# EAGLE design ethernet chip board (EAGLE 7.5.0)
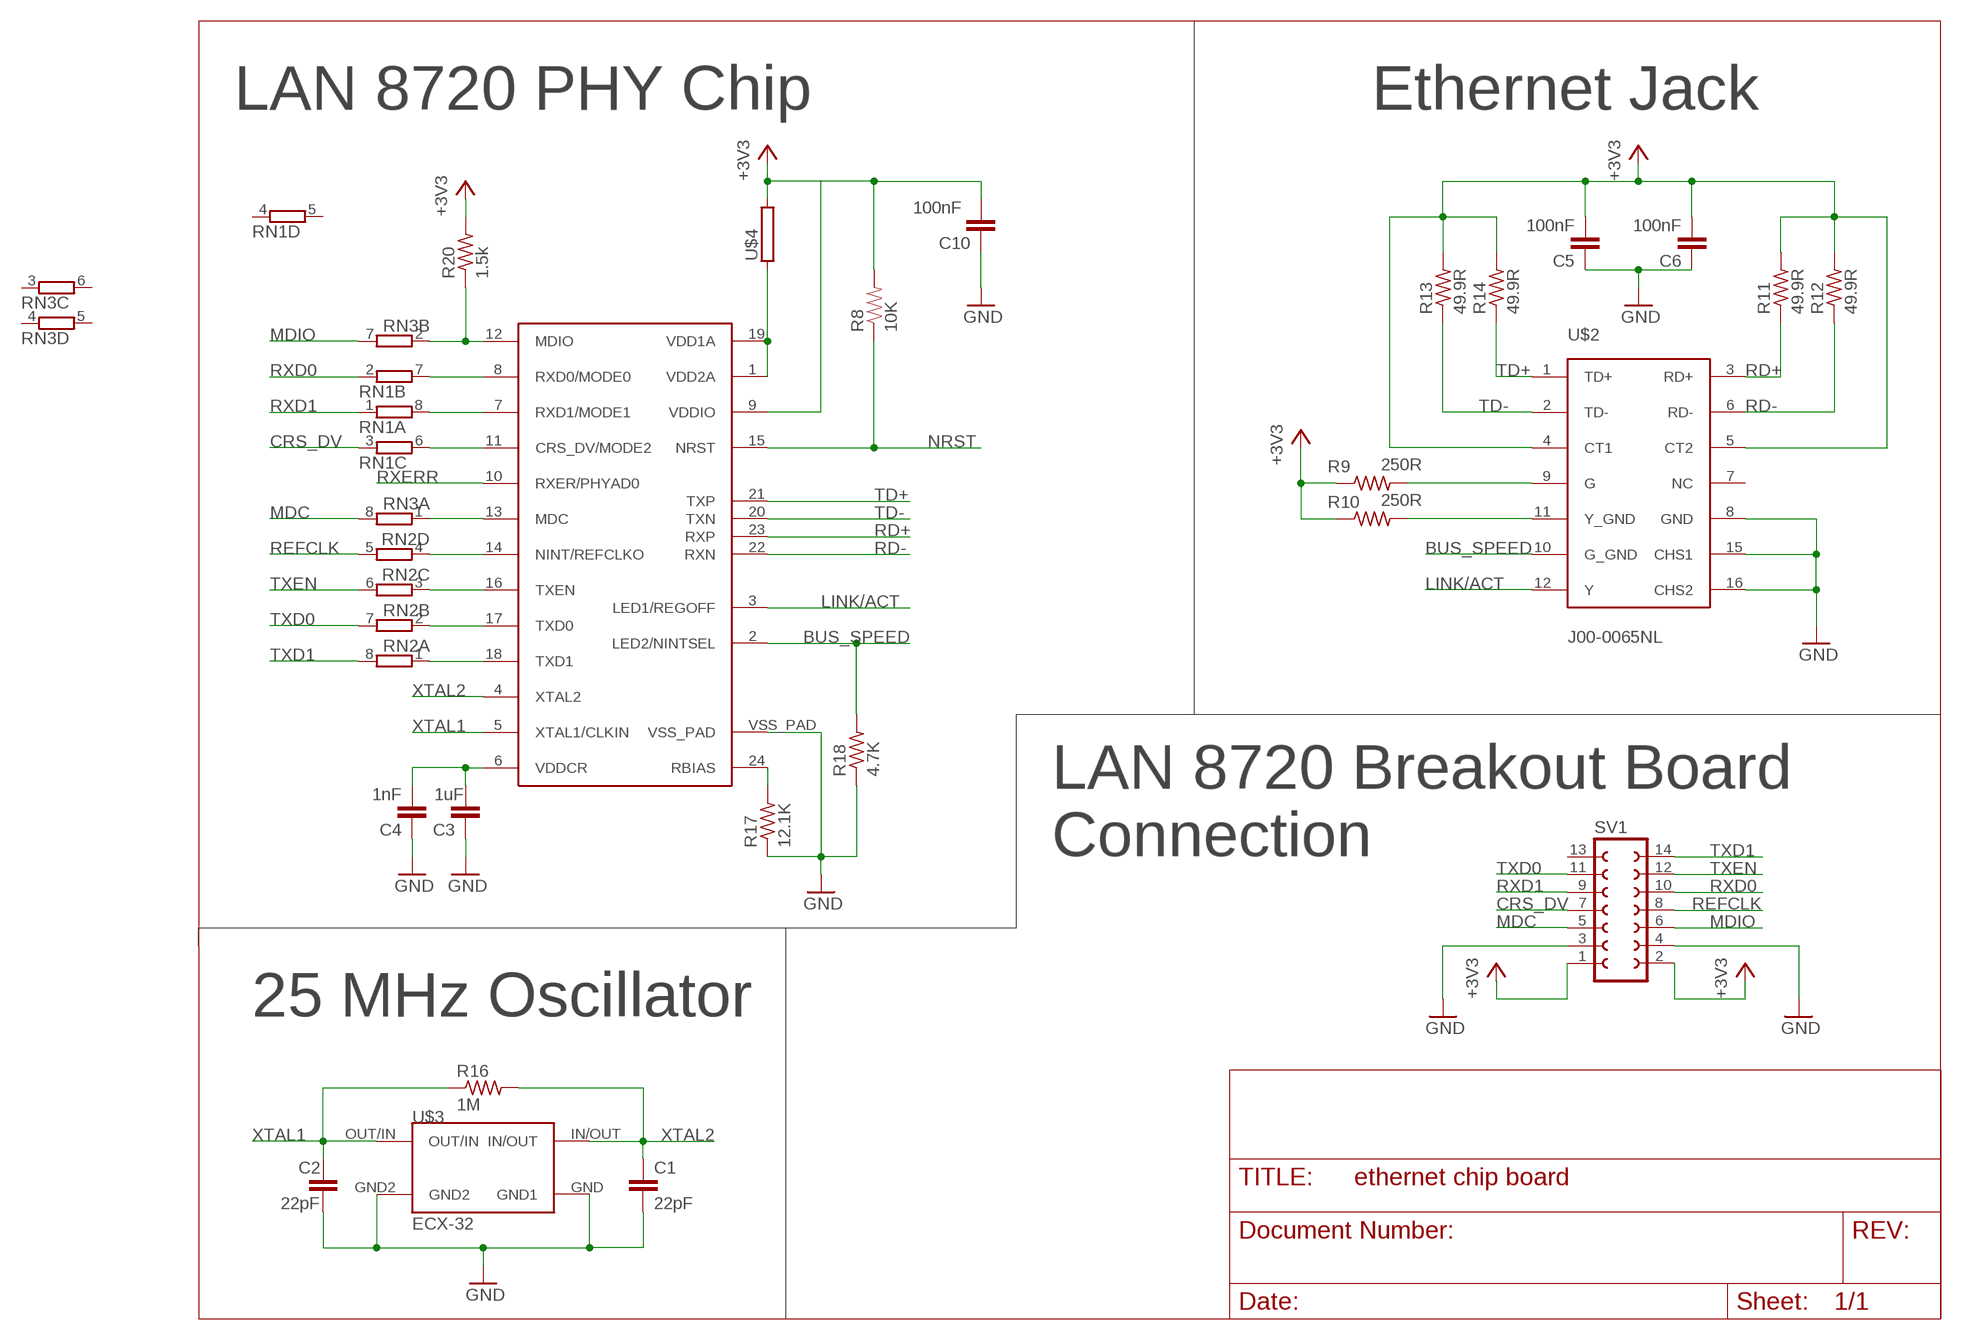
[diagram p0: schematic, sheet 1]

## Parts
C1  22pF  CC0603  [C0603]
C2  22pF  CC0603  [C0603]
C3  1uF  CC0603  [C0603]
C4  1nF  CC0603  [C0603]
C5  100nF  CC0603  [C0603]
C6  100nF  CC0603  [C0603]
C10  100nF  CC0603  [C0603]
R8  10K  RESISTOR0603-RES  [0603-RES]
R9  250R  R-US_R0603  [R0603]
R10  250R  R-US_R0603  [R0603]
R11  49.9R  R-US_R0603  [R0603]
R12  49.9R  R-US_R0603  [R0603]
R13  49.9R  R-US_R0603  [R0603]
R14  49.9R  R-US_R0603  [R0603]
R16  1M  R-US_R0603  [R0603]
R17  12.1K  R-US_R0603  [R0603]
R18  4.7K  R-US_R0603  [R0603]
R20  1.5k  R-US_R0603  [R0603]
RN1  4R-NCAY16  [CAY16]
RN2  4R-NCAY16  [CAY16]
RN3  4R-NCAY16  [CAY16]
SV1  FE07-2  [FE07-2]
U$1  LAN8720LAN8720  [24-QFN]
U$2  J00-0065NL  [J00-0065NL]
U$3  ECX-32  [ECX-32]
U$4  553-2382-1-ND  [0603]

## Nets
+3V3: C5.2 C6.2 C10.2 R8.2 R9.1 R10.1 R11.2 R12.2 R13.2 R14.2 R20.2 SV1.1 SV1.2 U$1.9(VDDIO) U$2.4(CT1) U$2.5(CT2) U$4.2
BUS_SPEED: R18.2 U$1.2(LED2/NINTSEL) U$2.10(G_GND)
CRS_DV: RN1.3 SV1.7
GND: C1.2 C2.2 C3.1 C4.1 C5.1 C6.1 C10.1 R17.1 R18.1 SV1.3 SV1.4 U$1.VSS_PAD U$2.8(GND) U$2.15(CHS1) U$2.16(CHS2) U$3.GND2 U$3.GND(GND1)
GREEN: R9.2 U$2.9(G)
LINK/ACT: U$1.3(LED1/REGOFF) U$2.12(Y)
MDC: RN3.8 SV1.5
MDE: RN3.1 U$1.13(MDC)
MDIO: RN3.7 SV1.6
N$1: RN1.7 U$1.8(RXD0/MODE0)
N$2: RN1.8 U$1.7(RXD1/MODE1)
N$3: C3.2 C4.2 U$1.6(VDDCR)
N$4: R17.2 U$1.24(RBIAS)
N$5: RN1.6 U$1.11(CRS_DV/MODE2)
N$7: RN2.4 U$1.14(NINT/REFCLKO)
N$8: RN2.3 U$1.16(TXEN)
N$9: RN2.2 U$1.17(TXD0)
N$10: RN2.1 U$1.18(TXD1)
N$11: U$1.1(VDD2A) U$1.19(VDD1A) U$4.1
N$12: R20.1 RN3.2 U$1.12(MDIO)
NRST: R8.1 U$1.15(NRST)
RD+: R11.1 U$1.23(RXP) U$2.3(RD+)
RD-: R12.1 U$1.22(RXN) U$2.6(RD-)
REFCLK: RN2.5 SV1.8
RXD0: RN1.2 SV1.10
RXD1: RN1.1 SV1.9
RXERR: U$1.10(RXER/PHYAD0)
TD+: R14.1 U$1.21(TXP) U$2.1(TD+)
TD-: R13.1 U$1.20(TXN) U$2.2(TD-)
TXD0: RN2.7 SV1.11
TXD1: RN2.8 SV1.14
TXEN: RN2.6 SV1.12
XTAL1: C2.1 R16.1 U$1.5(XTAL1/CLKIN) U$3.OUT/IN
XTAL2: C1.1 R16.2 U$1.4(XTAL2) U$3.IN/OUT
YELLOW: R10.2 U$2.11(Y_GND)
Unconnected: RN1.4 RN1.5 RN3.3 RN3.4 RN3.5 RN3.6 SV1.13 U$2.7(NC)

## Notes on the sheet
- LAN 8720 PHY Chip | Ethernet Jack
- LAN 8720 Breakout Board 
  Connection
- 25 MHz Oscillator

## Library data of the parts
C1-C6 C10 = eagle-ltspice:C: CAPACITOR, European symbol; SPICEMODEL: NONE; SPICEPREFIX: C
R8 = SparkFun-Passives:RESISTOR: Resistor Basic schematic elements and footprints for 0603, 1206, and PTH resistors.
R9-R14 R16-R18 R20 = resistor:R-US_: RESISTOR, American symbol
RN1-RN3 = resistor-dil:4R-N: Array Chip Resistor Source: RS Component / Phycomp; OC_FARNELL: unknown; OC_NEWARK: unknown
SV1 = con-lsta:FE07-2: FEMALE HEADER; OC_FARNELL: unknown; OC_NEWARK: unknown
U$1 = EthernetChip:LAN8720
U$2 = EthernetChip:J00-0065NL: Ethernet port device.
U$3 = Other:ECX-32
U$4 = EthernetChip:553-2382-1-ND

## Board
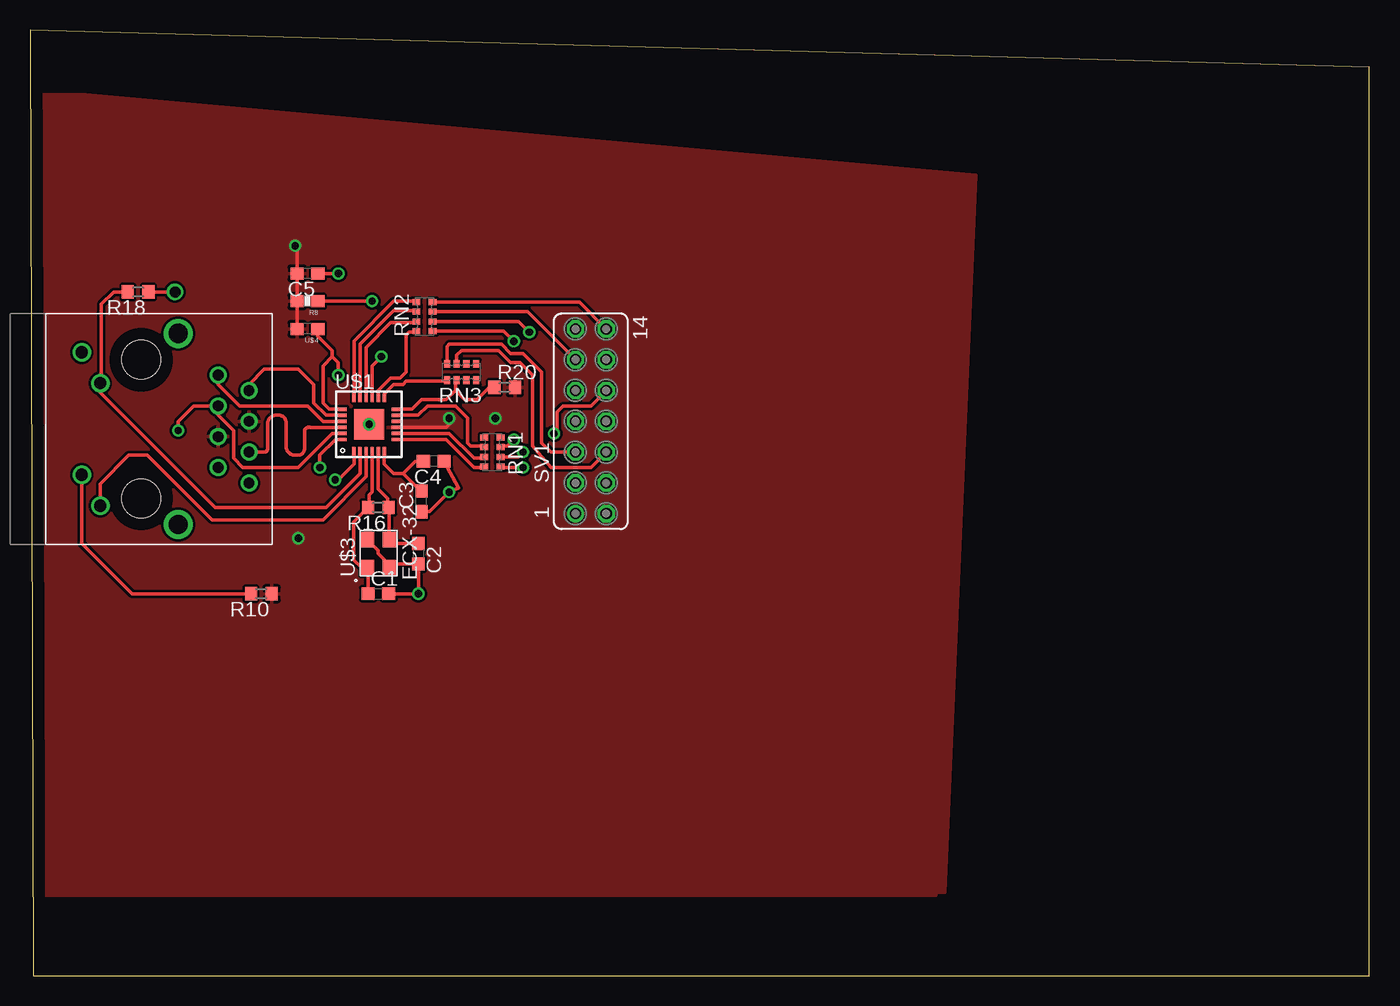
[diagram p1: board, top side]
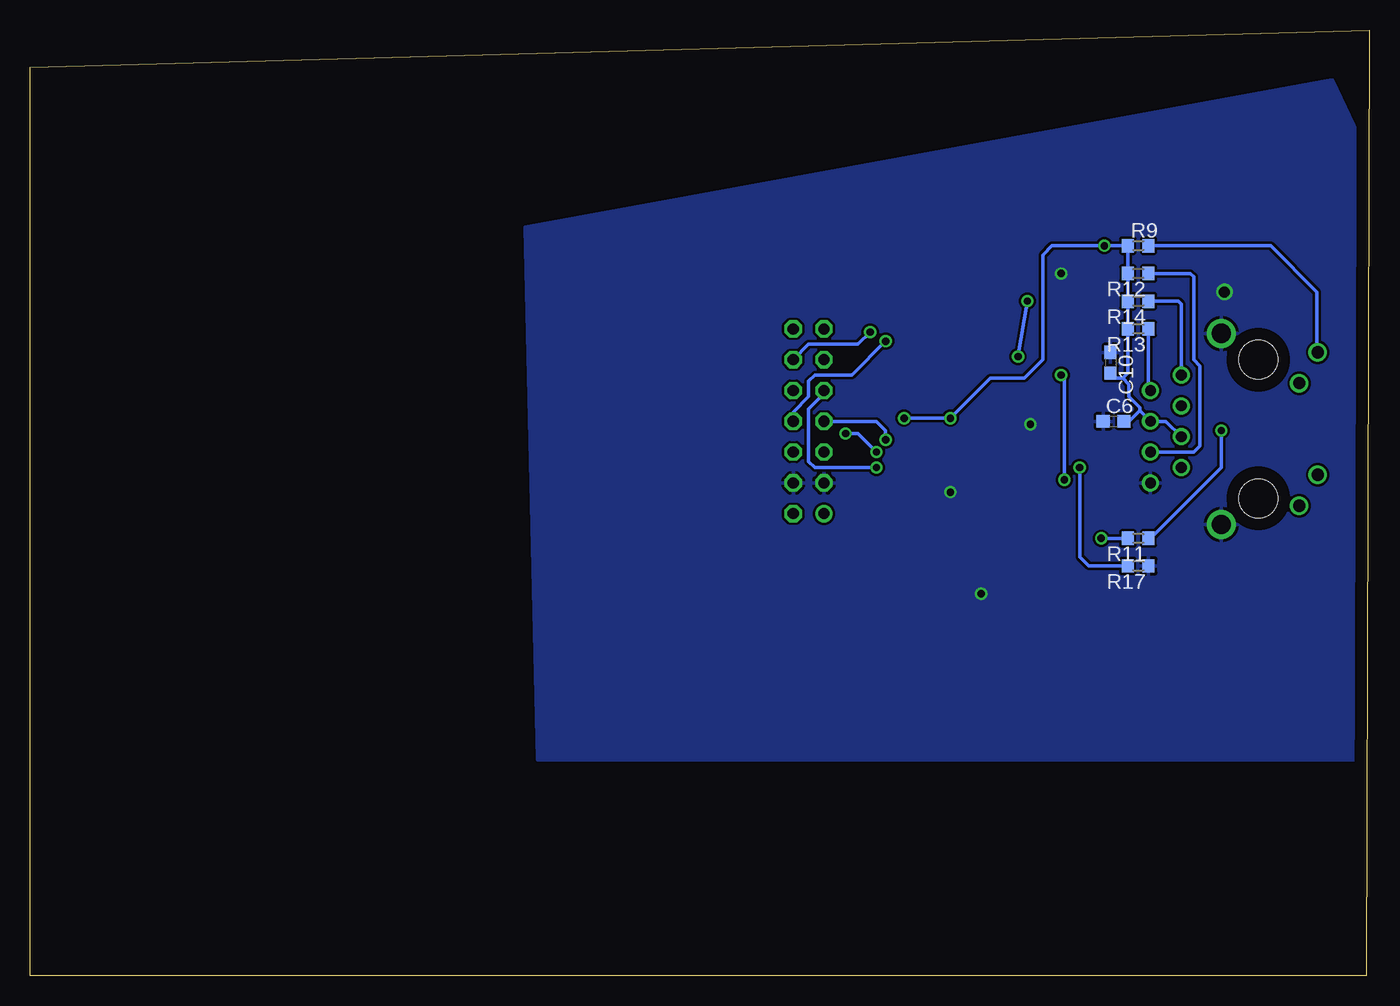
[diagram p2: board, bottom side, seen from below]

Size 110.41 x 77.97 mm. Coordinates in mm from the lower left corner, seen from the top.
Outline: 0.25,0 110.41,0 110.41,74.92 0,77.97 0.25,0
Copper layers (1*16): Top 0.035mm / dielectric 1.5mm / Bottom 0.035mm
Design rules "default": minimum track width 10mil, minimum drill 24mil, track to track 8mil, track to pad 8mil, pad to pad 8mil, via to via 8mil, smd to smd 8mil, copper to edge 40mil, drill to drill 8mil, minimum pad ring 10mil, minimum via ring 8mil, stop-mask expansion 4mil, vias tented up to drill 0mil, thermal gap 10mil

### Footprints (pad centres in the part's own frame; a part is rotated, then mirrored left to right if it is on the bottom)
C0603 = smd 1.1 x 1: 1 -0.85,0; 2 0.85,0
0603-RES = smd 1.1 x 1: 1 -0.85,0; 2 0.85,0
R0603 = smd 1 x 1.1: 1 -0.85,0; 2 0.85,0
CAY16 = smd 0.5 x 0.65: 1 -1.2,-0.675; 2 -0.4,-0.675; 3 0.4,-0.675; 4 1.2,-0.675; 5 1.2,0.675; 6 0.4,0.675; 7 -0.4,0.675; 8 -1.2,0.675
FE07-2 = drill 0.914: 1 -7.62,1.27 | drill 0.914 octagon: 2 -7.62,-1.27; 3 -5.08,1.27; 4 -5.08,-1.27; 5 -2.54,1.27; 6 -2.54,-1.27; 7 0,1.27; 8 0,-1.27; 9 2.54,1.27; 10 2.54,-1.27; 11 5.08,1.27; 12 5.08,-1.27; 13 7.62,1.27; 14 7.62,-1.27
24-QFN = smd 0.28 x 0.69: 1 -1.25,-2.195; 2 -0.75,-2.195; 3 -0.25,-2.195; 4 0.25,-2.195; 5 0.75,-2.195; 6 1.25,-2.195; 13 1.25,2.195; 14 0.75,2.195; 15 0.25,2.195; 16 -0.25,2.195; 17 -0.75,2.195; 18 -1.25,2.195 | smd 0.69 x 0.28: 7 2.195,-1.25; 8 2.195,-0.75; 9 2.195,-0.25; 10 2.195,0.25; 11 2.195,0.75; 12 2.195,1.25; 19 -2.195,1.25; 20 -2.195,0.75; 21 -2.195,0.25; 22 -2.195,-0.25; 23 -2.195,-0.75; 24 -2.195,-1.25 | smd 2.5 x 2.5: VSS_PAD 0,0
J00-0065NL = drill 0.889 pad 1.016: 1 1.27,2.54; 2 0,0; 3 -1.27,2.54; 4 -2.54,0; 5 -3.81,2.54; 6 -5.08,0; 7 -6.35,2.54; 8 -7.62,0 | drill 1.016 pad 1.143: 9 3.15,13.792; 10 0.61,12.268; 11 -6.96,13.792; 12 -9.5,12.268 | drill 1.6 pad 1.727: 15 4.699,5.842; 16 -11.049,5.842 | hole 3.2: -8.89,8.89; 2.54,8.89
ECX-32 = smd 1.3 x 1.1: GND 1.15,0.9; GND2 -1.15,-0.9; IN/OUT -1.15,0.9; OUT/IN 1.15,-0.9
0603 = smd 1.1 x 1: 1 -0.85,0; 2 0.85,0

### Placement (x,y rotation side)
C1  28.7,31.5 0 top
C2  32,34.8 270 top
C3  32.26,39.12 90 top
C4  33.27,42.42 180 top
C5  22.86,57.91 180 top
C6  21.08,45.72 0 bottom
C10  21.34,50.55 270 bottom
R8  22.86,55.63 180 top
R9  19.05,60.2 0 bottom
R10  19.05,31.5 180 top
R11  19.05,36.07 180 bottom
R12  19.05,57.91 180 bottom
R13  19.05,53.34 180 bottom
R14  19.05,55.63 180 bottom
R16  28.7,38.61 180 top
R17  19.05,33.78 180 bottom
R18  8.89,56.39 180 top
R20  39.12,48.51 0 top
RN1  38.1,43.18 90 top
RN2  32.51,54.36 270 top
RN3  35.56,49.78 0 top
SV1  46.23,45.72 90 top
U$1  27.94,45.47 0 top
U$2  18.03,48.26 90 top
U$3  28.7,34.8 90 top
U$4  22.86,53.34 180 top

### Tracks (layer width: path | path; a pad name or v marks a point on that pad's centre or on a via)
+3V3  (via drill 0.6)
  Top 0.305: v21.84,60.2 22.01,60.03 C5.2 R8.2 U$4.2 | 33.79,45.22 U$1.9 34.29,45.21 34.8,45.72 34.8,45.97 v34.54,45.97
  Bottom 0.305: 18.92,46.61 U$2.4 16.76,45.72 U$2.5 | C6.2 19.81,45.72 18.92,46.61 | 18.92,46.61 18.92,46.86 19.81,47.75 19.81,48.77 20.32,49.28 | 20.32,49.28 19.9,49.7 R13.2 R14.2 R12.2 R9.1 v21.84,60.2 26.16,60.2 26.92,59.44 26.92,50.8 28.45,49.28 31.24,49.28 v34.54,45.97 v38.35,45.97 | 20.32,49.28 21.25,49.28 C10.2 | v22.1,36.07 R11.2
  pour Top: 4.57,72.64 -0.76,72.64 -0.76,6.6 74.68,6.6 74.68,6.86 75.44,6.86 77.98,66.04
BUS_SPEED
  Top 0.305: U$1.2 27.19,41.41 24.38,38.61 15.24,38.61 5.77,48.08 U$2.10 5.84,48.95 5.84,55.37 6.86,56.39 R18.2
CRS_DV  (via drill 0.6)
  Top 0.305: RN1.3 38.88,43.69 39.37,43.69 v39.88,44.2
  Bottom 0.305: v39.88,44.2 39.88,44.96 40.64,45.72 SV1.7
GND  (via drill 0.6, 0.9)
  Top 0.305: 27.5,35.65 U$3.GND 28.7,35.05 28.7,34.8 29.6,33.9 U$3.GND2 29.9,33.95 C2.2 v32,31.5 C1.2 | C3.1 32.93,38.27 v34.54,39.88 35.31,40.22 C4.1 | R18.1 v11.94,56.39 | C5.1 v25.4,57.91
  other vias: 27.94,45.47
  pour Bottom: 3.05,73.91 69.6,61.72 68.58,17.78 -1.52,17.78 -1.52,17.27 -3.81,17.27 -3.3,60.45
GREEN
  Bottom 0.305: R9.2 8.13,60.2 4.32,56.39 4.32,51.49 U$2.9
LINK/ACT
  Top 0.305: U$2.12 5.77,40.56 8.13,42.93 9.65,42.93 14.99,37.59 24.13,37.59 27.69,41.15 U$1.3
MDC
  Top 0.305: RN3.8 34.36,51.89 34.54,52.07 38.86,52.07 39.62,51.31 40.64,51.31 42.16,49.78 42.16,43.94 42.93,43.18 SV1.5
MDE
  Top 0.305: U$1.13 29.19,47.99 29.97,48.77 30.73,48.77 30.99,49.02 34.27,49.02 RN3.1
MDIO
  Top 0.305: RN3.7 35.16,51.16 35.56,51.56 38.61,51.56 39.62,50.55 40.39,50.55 41.4,49.53 41.4,43.69 42.93,41.91 46.23,41.91 SV1.6
N$1
  Top 0.305: U$1.8 34.53,44.72 36.58,42.67 37.32,42.67 RN1.7
N$2
  Top 0.305: U$1.7 34.27,44.22 36.58,41.91 37.35,41.91 RN1.8
N$3
  Top 0.305: U$1.6 29.19,42.18 29.97,41.4 30.73,41.4 | 30.73,41.4 31.75,42.42 C4.2 | 30.73,41.4 32.17,39.97 C3.2
N$4  (via drill 0.6)
  Top 0.305: U$1.24 25.17,44.22 23.88,42.93 v23.88,41.91
  Bottom 0.305: R17.2 23.11,33.78 23.88,34.54 v23.88,41.91
N$5
  Top 0.305: U$1.11 31.99,46.22 32.77,46.99 35.05,46.99 36.07,45.97 36.07,43.94 36.32,43.69 37.32,43.69 RN1.6
N$7
  Top 0.305: U$1.14 28.69,48.25 29.72,49.28 30.48,49.28 30.99,49.78 30.99,52.83 31.24,53.09 31.77,53.09 RN2.4
N$8
  Top 0.305: U$1.16 27.69,51.82 29.72,53.85 31.73,53.85 RN2.3
N$9
  Top 0.305: U$1.17 27.19,52.08 29.97,54.86 31.73,54.86 RN2.2
N$10
  Top 0.305: U$1.18 26.69,52.34 29.97,55.63 31.77,55.63 RN2.1
N$11  (via drill 0.6)
  Top 0.305: U$1.19 25.73,46.74 24.64,46.74 24.13,47.24 24.13,50.29 24.89,51.05 | U$1.1 26.69,42.18 25.4,40.89 v25.15,40.89 | v25.4,49.53 25.4,50.55 24.89,51.05 | 24.89,51.05 24.89,51.56 23.71,52.74 U$4.1
  Bottom 0.305: v25.15,40.89 25.15,49.28 v25.4,49.53
N$12
  Top 0.305: U$1.12 31.48,46.72 32.26,47.5 34.29,47.5 35.05,48.26 | 35.05,48.26 35.05,49 RN3.2 | R20.1 37.76,48.43 36.83,47.5 35.81,47.5 35.05,48.26
NRST  (via drill 0.6)
  Top 0.305: R8.1 v28.19,55.63 | U$1.15 28.19,50.29 v28.96,51.05
  Bottom 0.305: v28.19,55.63 v28.96,51.05
RD+  (via drill 0.6)
  Top 0.305: U$1.23 24.9,44.72 22.1,41.91 17.53,41.91 16.76,42.67 16.76,44.96 15.49,46.23 U$2.3 13.46,46.99 12.19,45.72 v12.19,44.96
  Bottom 0.305: R11.1 18.03,36.07 12.19,41.91 v12.19,44.96
RD-
  Top 0.305: U$2.6 19.3,43.18 arc90 19.56,43.43 19.56,45.47 arc-90 20.32,46.23 20.57,46.23 arc-90 21.08,45.47 21.08,43.69 arc90 21.84,42.93 22.1,42.93 arc90 22.61,43.43 22.61,44.96 arc-90 23.11,45.21 arc-90 23.12,45.22 U$1.22
  Bottom 0.305: R12.1 14.73,57.91 14.48,57.66 14.48,50.8 13.97,50.29 13.97,43.69 14.48,43.18 U$2.6
REFCLK  (via drill 0.6)
  Top 0.305: RN2.5 39.05,53.16 v39.88,52.32
  Bottom 0.305: v39.88,52.32 42.67,49.53 45.72,49.53 46.23,49.02 46.23,47.75 47.5,46.48 SV1.8
RXD0  (via drill 0.6)
  Top 0.305: RN1.2 40.24,42.78 v40.64,43.18 | v43.18,44.7 43.43,44.96 43.43,46.48 43.94,46.99 46.23,46.99 SV1.10
  Bottom 0.305: v40.64,43.18 42.16,44.7 v43.18,44.7
RXD1  (via drill 0.6)
  Top 0.305: RN1.1 38.84,41.91 v40.64,41.91
  Bottom 0.305: v40.64,41.91 45.72,41.91 46.23,42.42 46.23,46.74 44.96,48.01 SV1.9
TD+
  Top 0.305: U$2.1 15.49,48.77 17.27,46.99 22.86,46.99 24.13,45.72 U$1.21
  Bottom 0.305: R14.1 15.75,55.63 15.49,55.37 U$2.1
TD-
  Top 0.305: U$2.2 18.03,48.77 19.3,50.04 22.1,50.04 23.37,48.77 23.37,47.24 24.4,46.22 U$1.20
  Bottom 0.305: R13.1 18.2,48.43 U$2.2
TXD0
  Top 0.305: RN2.7 41,54.76 SV1.11
TXD1
  Top 0.305: RN2.8 45.28,55.56 SV1.14
TXEN  (via drill 0.6)
  Top 0.305: RN2.6 40.28,53.96 v41.15,53.09
  Bottom 0.305: v41.15,53.09 42.16,52.07 46.23,52.07 SV1.12
XTAL1
  Top 0.305: C2.1 29.9,35.65 U$3.OUT/IN | U$1.5 28.69,40.14 29.46,39.37 29.46,38.7 R16.1 29.6,38.56 U$3.OUT/IN | U$3.OUT/IN 29.55,36
XTAL2
  Top 0.305: U$1.4 28.19,39.87 27.94,39.62 27.94,38.7 R16.2 26.67,37.43 26.67,34.29 27.31,33.65 U$3.IN/OUT 27.85,33.6 C1.1
YELLOW
  Top 0.305: U$2.11 4.24,35.64 8.38,31.5 R10.2